# EAGLE board apu_standalone (EAGLE 6.5.0)
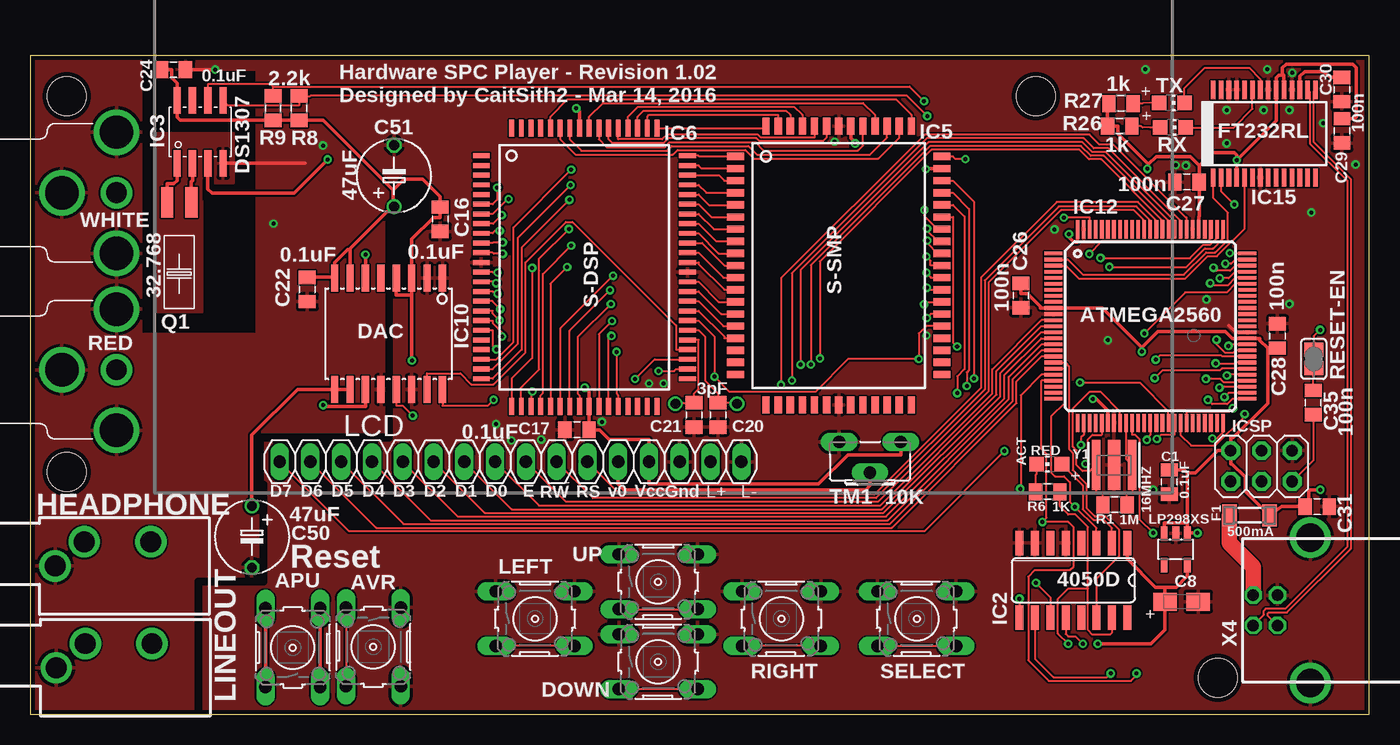
[diagram p6: board, top side]
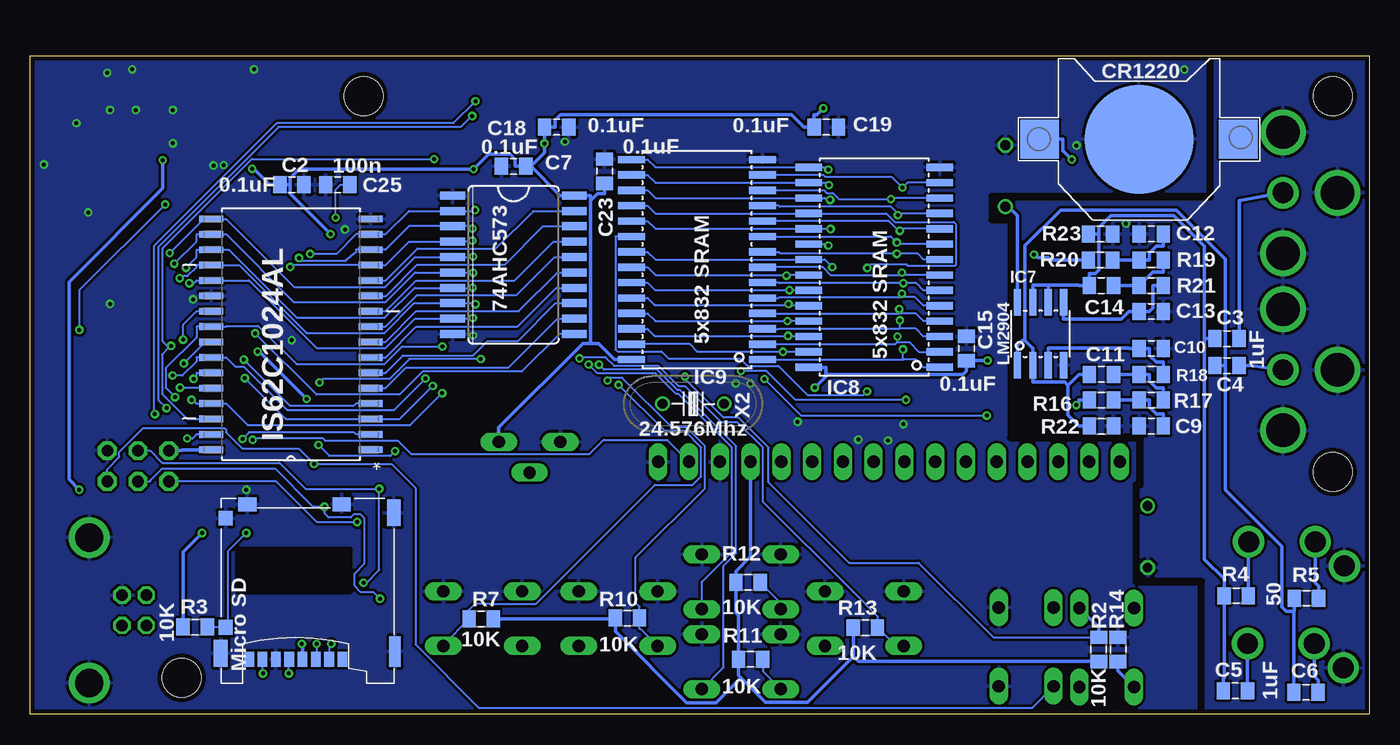
[diagram p7: board, bottom side, seen from below]

Size 110.49 x 54.36 mm. Coordinates in mm from the lower left corner, seen from the top.
Outline: 0,0 110.49,0 110.49,54.36 0,54.36 0,0
Copper layers (1*16): Top 0.0356mm / dielectric 1.5011mm / Bottom 0.0356mm
Design rules "oshpark-2layer": minimum track width 6mil, minimum drill 13mil, track to track 6mil, track to pad 6mil, pad to pad 6mil, via to via 6mil, smd to smd 6mil, copper to edge 15mil, drill to drill 6mil, minimum pad ring 7mil, minimum via ring 7mil, stop-mask expansion 4mil, vias tented up to drill 0mil, thermal gap 10mil
Net classes: 0 default: width 0.152 mm, clearance 0.152 mm; 1 supply: width 0.203 mm, clearance 0.152 mm; 2 audio: width 0.305 mm, clearance 0.152 mm; 3 power usb: width 0.508 mm, drill 0.406 mm, clearance 0.203 mm
Holes 3.2 mm at 3,51 98,3 83,51 3,20
tRestrict: 48 lines
bRestrict: 24 lines

## Footprints (pad centres in the part's own frame; a part is rotated, then mirrored left to right if it is on the bottom)
CHIP-LED0805 = smd 1.2 x 1.2: A 0,-1.05; C 0,1.05
B3F-10XX = drill 1.016 long: 1 -3.251,2.261; 2 3.251,2.261; 3 -3.251,-2.261; 4 3.251,-2.261
CR1220-SMD = smd 3.2 x 3.2: +$1 -8.2,0; +$2 8.2,0 | smd 9 x 9: - 0,0
C0805 = smd 1.1 x 1.4: 1 -1,0; 2 1,0
A/3216-18R = smd 1.95 x 1.5: + 1.375,0; - -1.375,0
TT5D6 = drill 0.813: + -2.54,0 | drill 0.813 octagon: - 2.54,0
SM-1206 = smd 1.2 x 1.8: 1 -1.65,0; 2 1.65,0
SO20W = smd 0.66 x 2.032: 1 -5.715,-5.029; 2 -4.445,-5.029; 3 -3.175,-5.029; 4 -1.905,-5.029; 5 -0.635,-5.029; 6 0.635,-5.029; 7 1.905,-5.029; 8 3.175,-5.029; 9 4.445,-5.029; 10 5.715,-5.029; 11 5.715,5.029; 12 4.445,5.029; 13 3.175,5.029; 14 1.905,5.029; 15 0.635,5.029; 16 -0.635,5.029; 17 -1.905,5.029; 18 -3.175,5.029; 19 -4.445,5.029; 20 -5.715,5.029
SO16 = smd 0.66 x 2.032: 1 -4.445,-3.073; 2 -3.175,-3.073; 3 -1.905,-3.073; 4 -0.635,-3.073; 5 0.635,-3.073; 6 1.905,-3.073; 7 3.175,-3.073; 8 4.445,-3.073; 9 4.445,3.073; 10 3.175,3.073; 11 1.905,3.073; 12 0.635,3.073; 13 -0.635,3.073; 14 -1.905,3.073; 15 -3.175,3.073; 16 -4.445,3.073
SO-08 = smd 0.6 x 2.2: 1 -1.905,-2.6; 2 -0.635,-2.6; 3 0.635,-2.6; 4 1.905,-2.6; 5 1.905,2.6; 6 0.635,2.6; 7 -0.635,2.6; 8 -1.905,2.6
SOT23-5L = smd 0.55 x 1.2: 1 -0.95,-1.3; 2 0,-1.3; 3 0.95,-1.3; 4 0.95,1.3; 5 -0.95,1.3
QFP64_SOT319 = smd 0.6 x 1.4: 1 -9,-8.5; 2 -8,-8.5; 3 -7,-8.5; 4 -6,-8.5; 5 -5,-8.5; 6 -4,-8.5; 7 -3,-8.5; 8 -2,-8.5; 9 -1,-8.5; 10 0,-8.5; 11 1,-8.5; 12 2,-8.5; 13 3,-8.5; 14 4,-8.5; 15 5,-8.5; 16 6,-8.5; 17 7,-8.5; 18 8,-8.5; 19 9,-8.5; 33 9,8.5; 34 8,8.5; 35 7,8.5; 36 6,8.5; 37 5,8.5; 38 4,8.5; 39 3,8.5; 40 2,8.5; 41 1,8.5; 42 0,8.5; 43 -1,8.5; 44 -2,8.5; 45 -3,8.5; 46 -4,8.5; 47 -5,8.5; 48 -6,8.5; 49 -7,8.5; 50 -8,8.5; 51 -9,8.5 | smd 1.4 x 0.6: 20 11.5,-6; 21 11.5,-5; 22 11.5,-4; 23 11.5,-3; 24 11.5,-2; 25 11.5,-1; 26 11.5,0; 27 11.5,1; 28 11.5,2; 29 11.5,3; 30 11.5,4; 31 11.5,5; 32 11.5,6; 52 -11.5,6; 53 -11.5,5; 54 -11.5,4; 55 -11.5,3; 56 -11.5,2; 57 -11.5,1; 58 -11.5,0; 59 -11.5,-1; 60 -11.5,-2; 61 -11.5,-3; 62 -11.5,-4; 63 -11.5,-5; 64 -11.5,-6
QFP80_SOT318 = smd 0.4 x 1.4: 1 -9.2,-8.5; 2 -8.4,-8.5; 3 -7.6,-8.5; 4 -6.8,-8.5; 5 -6,-8.5; 6 -5.2,-8.5; 7 -4.4,-8.5; 8 -3.6,-8.5; 9 -2.8,-8.5; 10 -2,-8.5; 11 -1.2,-8.5; 12 -0.4,-8.5; 13 0.4,-8.5; 14 1.2,-8.5; 15 2,-8.5; 16 2.8,-8.5; 17 3.6,-8.5; 18 4.4,-8.5; 19 5.2,-8.5; 20 6,-8.5; 21 6.8,-8.5; 22 7.6,-8.5; 23 8.4,-8.5; 24 9.2,-8.5; 41 9.2,8.5; 42 8.4,8.5; 43 7.6,8.5; 44 6.8,8.5; 45 6,8.5; 46 5.2,8.5; 47 4.4,8.5; 48 3.6,8.5; 49 2.8,8.5; 50 2,8.5; 51 1.2,8.5; 52 0.4,8.5; 53 -0.4,8.5; 54 -1.2,8.5; 55 -2,8.5; 56 -2.8,8.5; 57 -3.6,8.5; 58 -4.4,8.5; 59 -5.2,8.5; 60 -6,8.5; 61 -6.8,8.5; 62 -7.6,8.5; 63 -8.4,8.5; 64 -9.2,8.5 | smd 1.4 x 0.4: 25 11.5,-6; 26 11.5,-5.2; 27 11.5,-4.4; 28 11.5,-3.6; 29 11.5,-2.8; 30 11.5,-2; 31 11.5,-1.2; 32 11.5,-0.4; 33 11.5,0.4; 34 11.5,1.2; 35 11.5,2; 36 11.5,2.8; 37 11.5,3.6; 38 11.5,4.4; 39 11.5,5.2; 40 11.5,6; 65 -11.5,6; 66 -11.5,5.2; 67 -11.5,4.4; 68 -11.5,3.6; 69 -11.5,2.8; 70 -11.5,2; 71 -11.5,1.2; 72 -11.5,0.4; 73 -11.5,-0.4; 74 -11.5,-1.2; 75 -11.5,-2; 76 -11.5,-2.8; 77 -11.5,-3.6; 78 -11.5,-4.4; 79 -11.5,-5.2; 80 -11.5,-6
SO28X = smd 0.6 x 2.2: 1 -8.255,-5.4; 2 -6.985,-5.4; 3 -5.715,-5.4; 4 -4.445,-5.4; 5 -3.175,-5.4; 6 -1.905,-5.4; 7 -0.635,-5.4; 8 0.635,-5.4; 9 1.905,-5.4; 10 3.175,-5.4; 11 4.445,-5.4; 12 5.715,-5.4; 13 6.985,-5.4; 14 8.255,-5.4; 15 8.255,5.4; 16 6.985,5.4; 17 5.715,5.4; 18 4.445,5.4; 19 3.175,5.4; 20 1.905,5.4; 21 0.635,5.4; 22 -0.635,5.4; 23 -1.905,5.4; 24 -3.175,5.4; 25 -4.445,5.4; 26 -5.715,5.4; 27 -6.985,5.4; 28 -8.255,5.4
SO16W = smd 0.6 x 2.2: 1 -4.445,-4.6; 2 -3.175,-4.6; 3 -1.905,-4.6; 4 -0.635,-4.6; 5 0.635,-4.6; 6 1.905,-4.6; 7 3.175,-4.6; 8 4.445,-4.6; 9 4.445,4.6; 10 3.175,4.6; 11 1.905,4.6; 12 0.635,4.6; 13 -0.635,4.6; 14 -1.905,4.6; 15 -3.175,4.6; 16 -4.445,4.6
SOIC127P1412X305-32N = smd 1.981 x 0.559: 1 -6.579,9.525; 2 -6.579,8.255; 3 -6.579,6.985; 4 -6.579,5.715; 5 -6.579,4.445; 6 -6.579,3.175; 7 -6.579,1.905; 8 -6.579,0.635; 9 -6.579,-0.635; 10 -6.579,-1.905; 11 -6.579,-3.175; 12 -6.579,-4.445; 13 -6.579,-5.715; 14 -6.579,-6.985; 15 -6.579,-8.255; 16 -6.579,-9.525; 17 6.579,-9.525; 18 6.579,-8.255; 19 6.579,-6.985; 20 6.579,-5.715; 21 6.579,-4.445; 22 6.579,-3.175; 23 6.579,-1.905; 24 6.579,-0.635; 25 6.579,0.635; 26 6.579,1.905; 27 6.579,3.175; 28 6.579,4.445; 29 6.579,5.715; 30 6.579,6.985; 31 6.579,8.255; 32 6.579,9.525
TQFP100 = smd 1.5 x 0.3: 1 -8,6; 2 -8,5.5; 3 -8,5; 4 -8,4.5; 5 -8,4; 6 -8,3.5; 7 -8,3; 8 -8,2.5; 9 -8,2; 10 -8,1.5; 11 -8,1; 12 -8,0.5; 13 -8,0; 14 -8,-0.5; 15 -8,-1; 16 -8,-1.5; 17 -8,-2; 18 -8,-2.5; 19 -8,-3; 20 -8,-3.5; 21 -8,-4; 22 -8,-4.5; 23 -8,-5; 24 -8,-5.5; 25 -8,-6; 51 8,-6; 52 8,-5.5; 53 8,-5; 54 8,-4.5; 55 8,-4; 56 8,-3.5; 57 8,-3; 58 8,-2.5; 59 8,-2; 60 8,-1.5; 61 8,-1; 62 8,-0.5; 63 8,0; 64 8,0.5; 65 8,1; 66 8,1.5; 67 8,2; 68 8,2.5; 69 8,3; 70 8,3.5; 71 8,4; 72 8,4.5; 73 8,5; 74 8,5.5; 75 8,6 | smd 0.3 x 1.5: 26 -6,-8; 27 -5.5,-8; 28 -5,-8; 29 -4.5,-8; 30 -4,-8; 31 -3.5,-8; 32 -3,-8; 33 -2.5,-8; 34 -2,-8; 35 -1.5,-8; 36 -1,-8; 37 -0.5,-8; 38 0,-8; 39 0.5,-8; 40 1,-8; 41 1.5,-8; 42 2,-8; 43 2.5,-8; 44 3,-8; 45 3.5,-8; 46 4,-8; 47 4.5,-8; 48 5,-8; 49 5.5,-8; 50 6,-8; 76 6,8; 77 5.5,8; 78 5,8; 79 4.5,8; 80 4,8; 81 3.5,8; 82 3,8; 83 2.5,8; 84 2,8; 85 1.5,8; 86 1,8; 87 0.5,8; 88 0,8; 89 -0.5,8; 90 -1,8; 91 -1.5,8; 92 -2,8; 93 -2.5,8; 94 -3,8; 95 -3.5,8; 96 -4,8; 97 -4.5,8; 98 -5,8; 99 -5.5,8; 100 -6,8
SSOP28 = smd 0.381 x 1.499: 1 -4.225,-3.625; 2 -3.575,-3.625; 3 -2.925,-3.625; 4 -2.275,-3.625; 5 -1.625,-3.625; 6 -0.975,-3.625; 7 -0.325,-3.625; 8 0.325,-3.625; 9 0.975,-3.625; 10 1.625,-3.625; 11 2.275,-3.625; 12 2.925,-3.625; 13 3.575,-3.625; 14 4.225,-3.625; 15 4.225,3.625; 16 3.575,3.625; 17 2.925,3.625; 18 2.275,3.625; 19 1.625,3.625; 20 0.975,3.625; 21 0.325,3.625; 22 -0.325,3.625; 23 -0.975,3.625; 24 -1.625,3.625; 25 -2.275,3.625; 26 -2.925,3.625; 27 -3.575,3.625; 28 -4.225,3.625
2X03 = drill 0.95 pad 1.55 octagon: 1 -2.54,-1.27; 2 -2.54,1.27; 3 0,-1.27; 4 0,1.27; 5 2.54,-1.27; 6 2.54,1.27
1X16 = drill 1.016 long: 1 -19.05,0; 2 -16.51,0; 3 -13.97,0; 4 -11.43,0; 5 -8.89,0; 6 -6.35,0; 7 -3.81,0; 8 -1.27,0; 9 1.27,0; 10 3.81,0; 11 6.35,0; 12 8.89,0; 13 11.43,0; 14 13.97,0; 15 16.51,0; 16 19.05,0
SMD = smd 2.5 x 1: 1 2.25,-1; 2 2.25,1
R0805 = smd 1.1 x 1.4: 1 -1,0; 2 1,0
SJ = smd 1.168 x 1.6: 1 -0.762,0; 2 0.762,0
CA6H = drill 1.016 long: A -2.54,0; E 2.54,0; S 0,2.54
MICROSD-3 = smd 0.8 x 1.24: 1 0,0; 2 1.1,0; 3 2.2,0; 4 3.3,0; 5 4.4,0; 6 5.5,0; 7 6.6,0; 8 7.7,0 | smd 1.16 x 1.2: CD_GND 9.64,-11.62 | smd 1.16 x 1.25: CD_SWITCH 9.64,-2.62 | smd 0.95 x 2.5: G1 -4.345,-0.63 | smd 1.15 x 2.2: G2 10.045,-0.48; G3 -4.245,-12.08 | smd 1.5 x 1.15: G4 0.06,-12.755; G5 7.84,-12.755
SJ1-3533N = drill 1.727: GND -4.7,0; LEFT 3.2,2; RIGHT -2.3,2
RCJ-01X = drill 2.743: PGND1 0,5; PGND2 4.5,0; PGND3 0,-5 | drill 1.727: PSIG 0,0
QS = drill 0.8: 1 -2.54,0; 2 2.54,0
PN61729 = drill 0.95 octagon: 1 1.25,4.71; 2 -1.25,4.71; 3 -1.25,2.71; 4 1.25,2.71 | drill 2.33: P$1 -6,0; P$2 6,0
RESONATOR = smd 0.7 x 4.1: 1 -1.5,0; 3 1.5,0 | smd 1 x 4.1: 2 0,0

## Placement (x,y rotation side)
ACT  RED  [CHIP-LED0805]  84.08,20.64 90 top
APU  Reset  [B3F-10XX]  21.66,5.49 90 top
AVR  Reset  [B3F-10XX]  28.31,5.54 270 top
BAT  CR1220  [CR1220-SMD]  19,47.45 0 bottom
C1  0.1uF  [C0805]  93.98,19.15 270 top
C2  0.1uF  [C0805]  88.9,43.69 180 bottom
C3  1uF  [C0805]  11.73,30.99 0 bottom
C4  1uF  [C0805]  11.73,28.75 0 bottom
C5  1uF  [C0805]  11.04,1.94 0 bottom
C6  1uF  [C0805]  5.22,1.8 0 bottom
C7  0.1uF  [C0805]  70.61,45.21 0 bottom
C8  10uF/10V  [A/3216-18R]  95.01,9.27 180 top
C9  1000pF  [C0805]  17.98,23.77 0 bottom
C10  100pF  [C0805]  17.98,30.18 180 bottom
C11  1800pF  [C0805]  22.1,28.04 180 bottom
C12  1000pF  [C0805]  17.98,39.62 180 bottom
C13  100pF  [C0805]  17.98,33.22 180 bottom
C14  1800pF  [C0805]  22.1,35.36 180 bottom
C15  0.1uF  [C0805]  33.22,30.18 90 bottom
C16  0.1uF  [C0805]  33.83,40.84 270 top
C17  0.1uF  [C0805]  45.11,23.47 180 top
C18  0.1uF  [C0805]  67.06,48.46 0 bottom
C19  0.1uF  [C0805]  44.81,48.46 0 bottom
C20  3pF  [C0805]  56.77,24.69 90 top
C21  3pF  [C0805]  54.79,24.69 90 top
C22  0.1uF  [C0805]  22.86,35.05 90 top
C23  0.1uF  [C0805]  63.09,44.81 90 bottom
C24  0.1uF  [C0805]  11.81,53.19 0 top
C25  100n  [C0805]  85.12,43.69 180 bottom
C26  100n  [C0805]  81.74,34.55 270 top
C27  100n  [C0805]  95.45,43.92 180 top
C28  100n  [C0805]  102.92,31.22 90 top
C29  100n  [C0805]  108.25,48.14 270 top
C30  100n  [C0805]  108.24,51.55 90 top
C31  100n  [C0805]  106.2,17.12 0 top
C35  100n  [C0805]  105.87,25.7 270 top
C50  47uF  [TT5D6]  18.29,14.63 270 top
C51  47uF  [TT5D6]  30.02,44.42 90 top
DOWN  DOWN  [B3F-10XX]  51.82,4.32 0 top
F1  500mA  [SM-1206]  100.62,16.4 180 top
IC1  74AHC573  [SO20W]  70.61,37.08 270 bottom
IC2  4050D  [SO16]  86.08,11.04 180 top
IC3  DS1307  [SO-08]  14.02,48.06 0 top
IC4  LP298XS  [SOT23-5L]  94.53,13.59 180 top
IC5  S-SMP  [QFP64_SOT319]  66.71,37.03 270 top
IC6  S-DSP  [QFP80_SOT318]  45.72,36.88 270 top
IC7  LM2904  [SO-08]  27.13,31.39 0 bottom
IC8  5x832 SRAM  [SO28X]  40.84,36.88 90 bottom
IC9  5x832 SRAM  [SO28X]  55.47,37.52 90 bottom
IC10  DAC  [SO16W]  29.57,31.39 180 top
IC11  IS62C1024AL  [SOIC127P1412X305-32N]  88.98,31.34 180 bottom
IC12  ATMEGA2560  [TQFP100]  92.42,32.02 0 top
IC15  FT232RL  [SSOP28]  101.83,47.9 0 top
ICSP  3x2M  [2X03]  101.6,20.47 0 top
JP1  LCD  [1X16]  39.62,20.83 0 top
LEFT  LEFT  [B3F-10XX]  41.66,7.87 0 top
Q1  32.768  [SMD]  12.29,39.98 90 top
R1  1M  [R0805]  89.5,17.28 180 top
R2  10K  [R0805]  22.33,5.33 90 bottom
R3  10K  [R0805]  96.89,7.19 0 bottom
R4  50  [R0805]  10.97,9.75 180 bottom
R5  50  [R0805]  5.18,9.55 180 bottom
R6  1K  [R0805]  83.97,18.34 180 top
R7  10K  [R0805]  73.28,7.85 180 bottom
R8  2.2k  [R0805]  22.17,50.01 270 top
R9  2.2k  [R0805]  20.04,50.01 90 top
R10  10K  [R0805]  61.21,7.92 0 bottom
R11  10K  [R0805]  51.05,4.53 0 bottom
R12  10K  [R0805]  51.26,10.88 0 bottom
R13  10K  [R0805]  41.58,7.14 0 bottom
R14  470  [R0805]  20.73,5.33 270 bottom
R16  22K  [R0805]  22.1,25.91 180 bottom
R17  22K  [R0805]  17.98,25.91 180 bottom
R18  22K  [R0805]  17.98,28.04 180 bottom
R19  22K  [R0805]  17.98,37.49 180 bottom
R20  22K  [R0805]  22.17,37.49 0 bottom
R21  22K  [R0805]  17.98,35.36 180 bottom
R22  5.1K  [R0805]  22.1,23.77 0 bottom
R23  5.1K  [R0805]  22.17,39.62 0 bottom
R26  1k  [R0805]  89.9,48.53 180 top
R27  1k  [R0805]  90,50.39 180 top
RESET-EN  [SJ]  105.92,29.31 90 top
RIGHT  RIGHT  [B3F-10XX]  61.98,7.87 0 top
RX  [CHIP-LED0805]  94.28,48.42 270 top
SELECT  SELECT  [B3F-10XX]  73.15,7.87 0 top
TM1  10K  [CA6H]  69.29,22.47 180 top
TX  [CHIP-LED0805]  94.2,50.45 270 top
U$1  MICROSD-2  [MICROSD-3]  84.73,4.53 180 bottom
U$2  HEADPHONE  [SJ1-3533N]  6.75,12.22 0 top
U$3  HEADPHONE  [SJ1-3533N]  6.84,3.82 0 top
U$4  RCA  [RCJ-01X]  7.11,43.02 180 top
U$5  RCA  [RCJ-01X]  7.11,28.42 180 top
UP  UP  [B3F-10XX]  51.82,10.92 0 top
X2  24.576Mhz  [QS]  55.78,25.6 180 bottom
X4  [PN61729]  105.63,8.56 90 top
Y1  16MHZ  [RESONATOR]  89.43,20.56 0 top

## Tracks (layer width: path | path; a pad name or v marks a point on that pad's centre or on a via)
!CE0  (via drill 0.33 pad 0.69)
  Top 0.152: IC6.28 42.12,26.31 42.3,26.49 42.3,36.33 v44.64,38.66
  Bottom 0.152: IC8.20 44.76,38.79 v44.64,38.66
!CE1  (via drill 0.33 pad 0.69)
  Top 0.152: v41.44,26.63 41.32,26.51 IC6.27
  Bottom 0.152: IC9.20 62.2,39.42 62.2,30.09 62.05,29.93 58.41,29.93 57.82,29.35 51.9,29.35 51.29,28.73 48.75,28.73 46.36,26.34 41.73,26.34 v41.44,26.63
!OE  (via drill 0.33 pad 0.69)
  Top 0.152: v48.09,36.18 43.72,31.81 IC6.30
  Bottom 0.152: IC9.22 59.55,36.88 58.91,36.25 48.09,36.25 | 48.09,36.25 v48.09,36.18 | IC8.22 48.09,36.25
!RD  (via drill 0.33 pad 0.69)
  Top 0.152: IC5.46 76.14,41.03 76.14,30.68 v76.49,30.34 | IC12.52 98.9,26.52 v98.55,26.16
  Bottom 0.152: v76.49,30.34 79.8,30.34 81.25,28.88 88.53,28.88 91.7,32.05 94.26,32.05 94.33,31.98 IC11.24 96.77,31.98 96.77,31.09 99.32,28.55 99.32,26.94 v98.55,26.16
!WE  (via drill 0.33 pad 0.69)
  Top 0.152: v48.38,29.9 48.38,26.45 48.52,26.31 IC6.36
  Bottom 0.152: IC8.27 v48.38,29.9 55.43,29.9 56.06,30.53 IC9.27
!WR  (via drill 0.33 pad 0.69)
  Top 0.152: IC12.51 99.21,26.02 98.77,25.58 97.53,25.58 v97.18,25.93 | IC5.47 76.14,42.03 77.09,41.08 77.09,28.47 76.5,27.88 v76.5,26.49
  Bottom 0.152: v76.5,26.49 79.14,23.85 92.56,23.85 94.33,25.63 IC11.29 96.77,25.63 97.08,25.93 v97.18,25.93
+3V3  (via drill 0.33 pad 0.69)
  Top 0.305: 93.63,10.47 94.56,10.47 95.48,11.39 IC4.5 | 93.63,10.47 92.85,10.47 90.53,12.79 IC2.1 | 93.63,10.47 C8.+ 93.63,6.94 92.49,5.79 v88.09,5.79
  Bottom 0.305: U$1.4 88.03,5.74 v88.09,5.79
A0
  Bottom 0.152: IC11.12 81.18,35.79 78.54,38.42 72.08,38.42 68.97,41.53 IC1.19
A1
  Bottom 0.152: IC11.11 81.14,34.52 78.56,37.09 71.33,37.09 68.16,40.26 IC1.18
A2
  Bottom 0.152: IC11.10 81.16,33.25 78.64,35.77 70.53,35.77 67.31,38.99 IC1.17
A3
  Bottom 0.152: IC11.9 81.18,31.98 78.56,34.6 70.36,34.6 67.24,37.72 IC1.16
A4
  Bottom 0.152: IC11.8 81.18,30.71 78.63,33.25 70.19,33.25 67,36.45 IC1.15
A5
  Bottom 0.152: IC11.7 81.18,29.44 78.65,31.97 70.29,31.97 67.08,35.18 IC1.14
A6
  Bottom 0.152: IC11.6 81.18,28.17 79.73,29.61 73.95,29.61 72.77,30.79 70.25,30.79 67.13,33.91 IC1.13
A7
  Bottom 0.152: IC11.5 81.18,26.9 79.47,28.61 71.03,28.61 67,32.64 IC1.12
A8  (via drill 0.33 pad 0.69)
  Top 0.152: IC12.53 98.21,27.02 v98.14,26.94
  Bottom 0.152: IC11.28 98.09,26.9 v98.14,26.94
A9  (via drill 0.33 pad 0.69)
  Top 0.152: IC12.54 99.44,27.52 99.3,27.37 98.51,27.37 98.22,27.67 v97.03,27.67
  Bottom 0.152: v97.03,27.67 96.77,27.92 96.77,28.17 IC11.27
A10  (via drill 0.33 pad 0.69)
  Top 0.152: IC12.55 98.82,28.02 v98.75,27.94 | IC5.49 76.14,44.03 77.89,42.28 v77.89,27.69
  Bottom 0.152: v98.75,27.94 97.94,27.94 96.77,29.11 96.77,29.44 IC11.26 94.33,29.44 93.58,28.68 92.86,28.68 89.28,25.1 80.47,25.1 v77.89,27.69
A11  (via drill 0.33 pad 0.69)
  Top 0.152: IC5.48 76.14,43.03 77.47,41.7 77.47,28.39 77.28,28.2 v77.28,27.07 | IC12.56 98.33,28.52 98.18,28.37 93.42,28.37 v92.78,27.72
  Bottom 0.152: v77.28,27.07 80,24.36 IC11.3 89.42,24.36 v92.78,27.72
A12  (via drill 0.33 pad 0.69)
  Top 0.152: IC12.57 99.44,29.02 99.38,28.95 v97.82,28.95
  Bottom 0.152: v97.82,28.95 96.06,30.71 IC11.25
A13  (via drill 0.33 pad 0.69)
  Top 0.152: IC12.58 98.36,29.52 98.31,29.57 93.19,29.57 v92.87,29.25
  Bottom 0.152: IC11.4 83.62,25.63 83.81,25.43 89.05,25.43 v92.87,29.25
A14  (via drill 0.33 pad 0.69)
  Top 0.152: IC12.59 99.44,30.02 99.25,29.82 98.61,29.82 97.89,30.55 v97.89,30.91
  Bottom 0.152: v97.89,30.91 97.89,32.14 96.77,33.25 IC11.23
A15  (via drill 0.33 pad 0.69)
  Top 0.152: IC12.60 99,30.52 v98.88,30.39 | v77.17,45.81 76.36,45.81 76.14,46.03 IC5.51
  Bottom 0.152: 99.06,30.25 99.02,30.25 v98.88,30.39 | 99.06,30.25 99.62,29.68 99.62,26.43 97.55,24.36 | 97.55,24.36 | 97.55,24.36 IC11.30 | 99.06,30.25 99.56,30.75 99.56,38.46 92.21,45.81 v77.17,45.81
A16  (via drill 0.33 pad 0.69)
  Top 0.152: IC12.50 98.42,23.26 97.92,22.76 v97.54,22.76
  Bottom 0.152: IC11.31 96.77,23.09 97.11,22.76 v97.54,22.76
A17  (via drill 0.33 pad 0.69)
  Top 0.152: v92.97,22.71 93.31,23.04 94.42,23.04 IC12.42
  Bottom 0.152: v92.97,22.71 92.43,23.25 83.78,23.25 83.62,23.09 IC11.2
A18  (via drill 0.33 pad 0.69)
  Top 0.152: v38.74,39.89 38.36,39.89 38.15,39.68 IC6.9
  Bottom 0.152: IC8.10 38.58,40.06 v38.74,39.89 38.85,39.89 39.65,40.69 IC9.10
A19  (via drill 0.33 pad 0.69)
  Top 0.152: v38.99,38.93 38.2,38.93 38.15,38.88 IC6.10
  Bottom 0.152: IC8.9 38.85,38.79 v38.99,38.93 39.49,39.42 IC9.9
A20  (via drill 0.33 pad 0.69)
  Top 0.152: v38.99,38 38.23,38 38.15,38.08 IC6.11
  Bottom 0.152: IC9.8 48.74,38.15 48.64,38.04 39.04,38.04 v38.99,38 37.25,38 36.77,37.52 IC8.8
A21  (via drill 0.33 pad 0.69)
  Top 0.152: v38.56,36.44 38.19,36.44 38.15,36.48 IC6.13
  Bottom 0.152: IC8.7 38.37,36.25 v38.56,36.44 38.79,36.22 44.43,36.22 45.09,36.88 IC9.7
A22  (via drill 0.33 pad 0.69)
  Top 0.152: v38.43,35.57 38.26,35.57 38.15,35.68 IC6.14
  Bottom 0.152: IC8.6 36.77,34.98 37.37,35.57 v38.43,35.57 48.7,35.57 48.74,35.61 IC9.6
A23  (via drill 0.33 pad 0.69)
  Top 0.152: v38.57,34.7 38.33,34.7 38.15,34.88 IC6.15
  Bottom 0.152: IC9.5 48.74,34.34 48.67,34.41 38.57,34.41 | IC8.5 36.77,33.71 37.48,34.41 38.57,34.41 | 38.57,34.41 v38.57,34.7
A24  (via drill 0.33 pad 0.69)
  Top 0.152: v38.79,33.42 38.15,34.06 38.15,34.08 IC6.16
  Bottom 0.152: IC8.4 36.77,32.44 37.41,33.07 38.79,33.07 | 38.79,33.07 v38.79,33.42 | IC9.4 38.79,33.07
A25  (via drill 0.33 pad 0.69)
  Top 0.152: v38.73,32.49 38.15,33.08 38.15,33.28 IC6.17
  Bottom 0.152: IC8.3 36.77,31.17 37.41,31.81 38.73,31.81 | IC9.3 48.74,31.8 48.74,31.81 38.73,31.81 | 38.73,31.81 v38.73,32.49
A26  (via drill 0.33 pad 0.69)
  Top 0.152: v48,32.44 46.92,31.36 IC6.34
  Bottom 0.152: IC9.25 59.55,33.07 58.91,32.44 v48,32.44 IC8.25
A27  (via drill 0.33 pad 0.69)
  Top 0.152: v47.91,33.84 45.17,31.1 45.17,26.45 45.32,26.31 IC6.32
  Bottom 0.152: 47.91,33.76 v47.91,33.84 | IC8.24 47.86,33.71 47.91,33.76 | IC9.24 59.55,34.34 58.97,33.76 47.91,33.76
A28  (via drill 0.33 pad 0.69)
  Top 0.152: v44.31,36.9 42.92,35.52 IC6.29
  Bottom 0.152: v44.31,36.9 44.91,37.51 44.91,37.52 IC8.21 58.91,37.52 59.55,38.15 IC9.21
A29  (via drill 0.33 pad 0.69)
  Top 0.152: IC6.31 44.52,31.66 v47.85,34.99
  Bottom 0.152: IC9.23 59.55,35.61 58.92,34.99 v47.85,34.99 47.84,34.98 IC8.23
A30  (via drill 0.33 pad 0.69)
  Top 0.152: IC6.18 38.15,32.48 38.15,32.27 38.94,31.48 v38.94,31.16
  Bottom 0.152: 38.94,30.69 37.95,30.69 37.15,29.9 IC8.2 | IC9.2 39.1,30.53 38.94,30.69 | 38.94,30.69 v38.94,31.16
A31  (via drill 0.33 pad 0.69)
  Top 0.152: IC6.35 47.72,30.99 v47.95,31.22
  Bottom 0.152: IC8.26 47.9,31.17 v47.95,31.22 58.96,31.22 59.55,31.8 IC9.26
A32  (via drill 0.33 pad 0.69)
  Top 0.152: IC6.19 38.15,31.68 38.15,30.42 v38.46,30.1
  Bottom 0.152: IC8.1 36.77,28.63 37.41,29.26 38.46,29.26 | 38.46,29.26 v38.46,30.1 | IC9.1 38.46,29.26
A.REF
  Top 0.305: C50.+ 18.29,23.02 22.06,26.79 IC10.9 IC10.10
ALEFT
  Bottom 0.305: IC7.7 27.76,35.4 26.49,35.4 | IC7.6 26.49,35.4 | 26.49,35.4 24,35.4 23.95,35.36 C14.2 23.1,36.36 22.61,36.36 22.32,36.65 22.32,39.62 | C5.1 12.04,2.94 11.97,3.01 R4.2 11.97,11.14 13.59,12.76 13.59,30.99 | R23.1 22.32,39.62 | 13.59,30.99 13.59,38.61 16.12,41.14 21.34,41.14 22.32,40.16 22.32,39.62 | C3.1 13.59,30.99
AREF  (via drill 0.33 pad 0.69)
  Top 0.152: IC12.98 87.42,40.99 85.31,40.99 v85.3,40.98
  Bottom 0.152: v85.3,40.98 85.3,43.28 84.89,43.69 C25.1
ARIGHT
  Bottom 0.305: 28.39,30.82 28.39,38.66 25.46,41.6 15.93,41.6 11.88,37.55 11.88,28.75 | 6.22,8.49 6.84,8.49 7.2,8.85 7.2,13.84 11.88,18.52 11.88,28.75 | R5.2 6.18,8.53 6.22,8.49 | IC7.1 29.03,30.4 28.62,30.82 28.39,30.82 | 28.39,30.82 27.78,30.2 27.76,30.2 IC7.2 27.76,27.39 25.1,27.39 24.85,27.14 | C4.1 11.88,28.75 | C6.1 6.22,8.49 | R22.1 23.95,23.77 24.85,24.68 24.85,27.14 | C11.2 23.95,28.04 24.85,27.14
BCK  (via drill 0.33 pad 0.69)
  Top 0.152: IC10.16 34.01,25.47 37.76,25.47 v38.23,25.94 | v51.84,28.32 53.12,28.32 53.29,28.48 IC6.42
  Bottom 0.152: v38.23,25.94 47.35,25.94 49.73,28.32 v51.84,28.32
BUF_CLK  (via drill 0.33)
  Top 0.152: IC2.10 82.91,4.57 84.43,3.05 88.85,3.05 v89.15,3.35
  Bottom 0.152: v89.15,3.35 89.15,4.51 U$1.5
BUF_CS  (via drill 0.33)
  Top 0.152: 87.28,10.36 87.28,6.94 87.66,6.55 89.09,6.55 89.26,6.72 IC2.15 | 87.28,10.36 87.28,15.44 86.26,16.46 85.65,16.46 84.97,17.14 R6.1 | 87.28,10.36 85.65,10.36 84.81,9.53 84.81,6.63 v85.65,5.79
  Bottom 0.152: v85.65,5.79 85.83,5.61 U$1.2
BUF_DI  (via drill 0.33)
  Top 0.152: IC2.12 85.45,6.6 85.65,6.4 86.26,6.4 v86.87,5.79
  Bottom 0.152: v86.87,5.79 86.87,4.6 U$1.3
BUF_LED
  Top 0.152: ACT.A 85.13,20.6 86.86,18.87 86.86,16.9 87.73,16.03 88.59,16.03 89.26,15.36 IC2.2
CD  (via drill 0.33)
  Top 0.152: IC12.35 90.92,23.04 91.19,23.04 91.51,22.71 91.51,16.08 v92.66,14.94
  Bottom 0.152: v92.66,14.94 94.18,13.41 94.18,7.34 U$1.CD_SWITCH 94.41,7.19 R3.2
CLK  (via drill 0.33)
  Top 0.152: IC2.3 87.99,15.36 87.97,15.36 v86.22,17.11 85.81,17.52 85.81,19.12 85.31,19.62 84.57,19.62 84.23,19.95 84.23,24.56 85.4,25.73 85.4,28.52 IC12.20 | v81.64,9.53 IC2.9
  Bottom 0.152: ICSP.3 100.58,19.2 100.58,19.28 99.59,20.27 90.3,20.27 87.17,17.14 86.26,17.14 v86.22,17.11 86.22,16.57 85.88,16.23 84.05,16.23 83.82,16.46 83.21,16.46 82.91,16.15 82.91,12.42 83.74,11.58 83.74,10.59 83.21,10.06 82.17,10.06 v81.64,9.53
CS
  Top 0.152: IC2.14 87.99,11.17 89.82,13 89.82,15.25 88.73,16.33 87.86,16.33 87.16,17.03 87.16,19 86.03,20.13 86.03,21.55 85.71,21.86 85.71,28.71 85.4,29.02 IC12.19
D0  (via drill 0.33 pad 0.69)
  Top 0.152: IC12.78 97.42,39.28 97.17,39.04 88.44,39.04 v87.39,37.98 | IC5.45 74.86,40.03 73.79,41.1 | 73.79,41.1 | 73.79,41.1 v73.79,41.61
  Bottom 0.152: v87.39,37.98 85.23,37.98 83.62,39.6 IC11.15 81.18,39.6 79.25,41.53 IC1.2 73.87,41.53 v73.79,41.61
D1  (via drill 0.33 pad 0.69)
  Top 0.152: v88.32,37.65 95.7,37.63 96.8,38.73 97.37,38.73 97.92,39.28 IC12.77 | IC5.44 74.88,39.03 74.01,39.9 | 74.01,39.9 | 74.01,39.9 v74.01,40.07
  Bottom 0.152: v88.32,37.65 88.1,37.39 84.51,37.39 83.62,38.15 83.62,38.33 IC11.14 81.18,38.33 79.25,40.26 IC1.3 74.19,40.26 v74.01,40.07
D2  (via drill 0.33 pad 0.69)
  Top 0.152: v89.05,36.91 95.41,36.91 96.93,38.43 97.62,38.43 98.42,39.23 IC12.76 | IC5.43 74.86,38.03 74.01,38.88 v74.01,39.09
  Bottom 0.152: v74.01,39.09 74.3,39.09 74.4,38.99 IC1.4 79.25,38.99 81.18,37.06 IC11.13 88.89,37.06 v89.05,36.91
D3  (via drill 0.33 pad 0.69)
  Top 0.152: IC5.42 74.28,37.03 74.28,37.43 v73.95,37.76 | IC12.75 99.02,38.02 v98.98,38.05
  Bottom 0.152: v73.95,37.76 73.99,37.72 IC1.5 78.74,37.72 81.21,35.25 88.72,35.25 94.33,40.87 IC11.17 96.17,40.87 v98.98,38.05
D4  (via drill 0.33 pad 0.69)
  Top 0.152: v73.94,36.43 74.28,36.09 74.28,36.03 IC5.41 | IC12.74 99.44,37.52 99.1,37.17 v98.62,37.17
  Bottom 0.152: v73.94,36.43 73.97,36.45 IC1.6 78.74,36.45 81.18,34 88.74,34 94.33,39.6 IC11.18 96.77,39.6 96.77,39.02 v98.62,37.17
D5  (via drill 0.33 pad 0.69)
  Top 0.152: v73.99,35.19 74.12,35.19 74.28,35.03 IC5.40 | IC12.73 99.44,37.02 99.02,36.59 97.89,36.59 v97.63,36.84
  Bottom 0.152: v73.99,35.19 74,35.18 IC1.7 78.77,35.18 81.23,32.71 88.49,32.71 94.11,38.33 IC11.19 96.77,38.33 96.77,37.7 v97.63,36.84
D6  (via drill 0.33 pad 0.69)
  Top 0.152: v73.76,33.83 73.96,34.03 IC5.39 | IC12.72 99.44,36.52 98.9,35.97 v98.16,35.97
  Bottom 0.152: v73.76,33.83 73.84,33.91 IC1.8 78.82,33.91 81.26,31.47 87.68,31.47 93.27,37.06 IC11.20 96.77,37.06 96.77,36.89 97.53,36.13 98,36.13 v98.16,35.97
D7  (via drill 0.33 pad 0.69)
  Top 0.152: IC5.38 74.28,33.03 74.28,32.99 v73.97,32.68 | IC12.71 99.43,36.02 98.8,35.39 97.54,35.39 v97.36,35.56
  Bottom 0.152: v73.97,32.68 74.02,32.64 IC1.9 78.74,32.64 81.18,30.2 86.84,30.2 92.43,35.79 IC11.21 96.77,35.79 97,35.56 v97.36,35.56
D8  (via drill 0.33 pad 0.69)
  Top 0.152: v38.91,41.18 38.2,40.48 IC6.8
  Bottom 0.152: 38.91,41.33 v38.91,41.18 | IC8.11 38.91,41.33 | 38.91,41.33 39.45,41.87 48.66,41.87 48.74,41.96 IC9.11
D9  (via drill 0.33 pad 0.69)
  Top 0.152: v39.47,42.51 39.37,42.51 38.15,41.28 IC6.7
  Bottom 0.152: IC8.12 39.38,42.6 v39.47,42.51 43.74,42.51 | IC9.12 45,43.23 44.79,43.02 44.26,43.02 43.74,42.51 | 43.74,42.51
D10  (via drill 0.33 pad 0.69)
  Top 0.152: v38.52,43.45 38.52,42.45 38.15,42.08 IC6.6
  Bottom 0.152: IC8.13 38.11,43.87 v38.52,43.45 39.4,44.33 44.88,44.33 45.05,44.5 IC9.13
D11  (via drill 0.33 pad 0.69)
  Top 0.152: IC6.22 38.45,29.28 39.88,30.71 39.88,40.17 v44.64,44.93
  Bottom 0.152: IC9.15 59.55,45.77 58.91,45.14 IC8.15 44.84,45.14 v44.64,44.93
D12  (via drill 0.33 pad 0.69)
  Top 0.152: IC6.23 38.15,28.48 40.24,30.57 40.24,39.32 v44.59,43.67
  Bottom 0.152: v44.59,43.67 44.79,43.87 IC8.16 58.91,43.87 59.55,44.5 IC9.16
D13  (via drill 0.33 pad 0.69)
  Top 0.152: v44.49,42.45 40.55,38.5 40.55,30.08 38.15,27.68 IC6.24
  Bottom 0.152: IC9.17 59.55,43.23 58.91,42.6 IC8.17 44.91,42.6 44.76,42.45 v44.49,42.45
D14  (via drill 0.33 pad 0.69)
  Top 0.152: v41.42,36.83 41.42,29.39 39.72,27.69 IC6.25
  Bottom 0.152: IC9.18 59.55,41.96 58.91,41.33 IC8.18 39.86,41.33 39.14,40.61 34.27,40.61 34.11,40.45 34.11,37.06 34.19,36.99 38.05,36.99 38.15,37.09 41.17,37.09 v41.42,36.83
D15  (via drill 0.33 pad 0.69)
  Top 0.152: IC6.26 40.52,26.98 41.99,28.45 41.99,36.59 41.99,37.6 v44.44,40.05
  Bottom 0.152: v44.44,40.05 v44.45,40.06 IC8.19 58.91,40.06 59.55,40.69 IC9.19
D_N
  Top 0.152: X4.2 101.8,8.2 101.8,8.53 101.96,8.69 103.57,8.69 108.66,13.78 108.66,44.03 105.59,47.1 105.59,51.34 IC15.16
D_P
  Top 0.152: X4.3 102.13,8.1 102.13,8.33 102.18,8.38 103.69,8.38 108.97,13.65 108.97,44.16 105.89,47.23 105.89,51.36 IC15.15
DI  (via drill 0.33 pad 0.69)
  Top 0.152: IC12.21 83.44,28.02 81.74,26.32 81.74,18.65 v81.69,18.59 | v82.99,10.83 84.18,9.64 IC2.11
  Bottom 0.152: ICSP.4 100.6,21.74 99.59,20.74 89.93,20.74 87.78,18.59 v81.69,18.59 81.69,11.89 82.74,10.83 v82.99,10.83
DO  (via drill 0.33)
  Top 0.152: IC12.22 83.44,27.52 83.44,21.9 83.86,21.49 83.86,16.19 v83.52,15.85 85.65,15.85 86.11,15.39 86.11,12.19 85.8,11.89 82.91,11.89 82.34,11.33 82.34,4.45 84.05,2.74 90.83,2.74 91.29,3.2 v91.29,3.35
  Bottom 0.152: v91.29,3.35 91.33,3.4 U$1.7 | v83.52,15.85 86.85,15.85 90.2,19.2 ICSP.1
DOWN  (via drill 0.33 pad 0.69)
  Top 0.152: IC12.84 94.42,40.75 88.78,46.4 87.63,46.4 86.82,47.2 74.13,47.2 63.57,36.65 v63.57,28.84 | DOWN.4 DOWN.3
  Bottom 0.152: R11.2 50.05,3.54 DOWN.3 | DOWN.4 53.27,3.85 53.27,9.4 53.27,12.24 52.25,13.27 52.25,22.13 56.86,26.74 57.08,26.74 58.76,28.42 63.15,28.42 v63.57,28.84
DSP_A0
  Top 0.152: IC6.60 55.15,42.88 56,42.03 IC5.5
DSP_A1
  Top 0.152: IC6.61 55.15,43.68 55.8,43.03 IC5.4
DSP_A2
  Top 0.152: IC6.62 56.83,44.48 57.28,44.03 IC5.3
DSP_A3
  Top 0.152: IC5.2 55.4,45.03 55.15,45.28 IC6.63
DSP_A4
  Top 0.152: IC5.1 55.2,46.03 55.15,46.08 IC6.64
DSP_A5
  Top 0.152: IC6.65 60.56,48.38 IC5.64
DSP_A6
  Top 0.152: IC6.66 50.92,49.31 51.07,49.46 61.71,49.46 IC5.63
DSP_A7
  Top 0.152: IC6.67 50.12,49.31 50.6,49.79 62.38,49.79 62.71,49.46 IC5.62
DSP_A8
  Top 0.152: IC6.68 49.32,49.31 50.14,50.13 63.04,50.13 63.71,49.46 IC5.61
DSP_A9
  Top 0.152: IC5.60 64.71,47.6 60.29,47.6 60.05,47.84 52.53,47.84 52.14,47.45 48.52,47.45 IC6.69
DSP_A10
  Top 0.152: IC5.59 65.71,47.6 65.4,47.29 60.17,47.29 59.92,47.54 52.66,47.54 52.25,47.12 48.05,47.12 47.72,47.45 IC6.70
DSP_A11
  Top 0.152: IC6.71 46.92,47.45 47.56,46.81 52.37,46.81 52.75,47.19 59.84,47.19 60.51,46.52 68.3,46.52 68.71,46.94 IC5.56
DSP_A12
  Top 0.152: IC6.72 46.12,49.31 47.25,50.44 68.73,50.44 69.71,49.46 IC5.55
DSP_A13
  Top 0.152: IC6.74 44.52,47.45 45.47,46.5 52.55,46.5 52.94,46.89 59.26,46.89 59.98,46.17 69.28,46.17 70.71,47.6 IC5.54
DSP_A14
  Top 0.152: IC6.75 43.72,47.45 44.99,46.18 53.04,46.18 53.42,46.56 59.02,46.56 59.71,45.87 69.98,45.87 71.71,47.6 IC5.53
DSP_A15
  Top 0.152: IC6.76 42.92,49.31 44.35,50.74 71.43,50.74 72.71,49.46 IC5.52
DSP_CPUK
  Top 0.152: IC6.48 55.15,33.28 57.28,31.15 57.28,31.03 IC5.16
DSP_D0
  Top 0.152: IC6.51 55.15,35.68 56.8,34.03 IC5.13
DSP_D1
  Top 0.152: IC6.53 55.15,37.28 55.15,37.16 57.28,35.03 IC5.12
DSP_D2
  Top 0.152: IC6.54 55.15,38.08 57.2,36.03 IC5.11
DSP_D3
  Top 0.152: IC6.55 55.43,38.88 57.28,37.03 IC5.10
DSP_D4
  Top 0.152: IC6.56 55.15,39.68 56.8,38.03 IC5.9
DSP_D5
  Top 0.152: IC6.57 55.15,40.48 56.6,39.03 IC5.8
DSP_D6
  Top 0.152: IC6.58 55.15,41.28 56.4,40.03 IC5.7
DSP_D7
  Top 0.152: IC6.59 55.15,42.08 56.2,41.03 IC5.6
DSP_PD2
  Top 0.152: IC6.49 55.15,34.08 57.2,32.03 IC5.15
DSP_PD3
  Top 0.152: IC6.50 55.15,34.88 57,33.03 IC5.14
DTR  (via drill 0.33 pad 0.69)
  Top 0.152: IC15.2 98.26,43.17 v99.36,42.06 | v106.44,31.71 105.92,31.19 RESET-EN.2 RESET-EN.1 105.87,28.5 C35.1
  Bottom 0.152: v99.36,42.06 106.44,34.99 v106.44,31.71
GND  (via drill 0.33 pad 0.69)
  Top 0.305: IC3.4 22.67,45.46 | v15.26,53.2 13.68,53.2 13.67,53.19 C24.2 | IC12.62 99.47,31.52 98.91,32.08
  other vias: 106.68,48.77 103.91,49.86 104.14,52.93 109.37,45.36 102.08,53.21 98.73,49.86 101.78,49.86 98.73,47.12 92.02,53.21 39.7,22.58 42.16,22.66 38.43,23.93 47.17,24.13 51.05,27.28 52.27,27.28 94.54,45.31 95.38,45.29 20.07,40.49 103.91,33.86 105.71,41.4 92.66,18.52 73.96,31.24 97.06,34.23 24.16,46.94 66.37,47.24 84.53,40 88.92,30.87
  pour Top: 10.52,33.17 10.52,47.96 16.76,47.96 16.76,43.84 15.24,43.84 15.24,46.58 14.17,46.58 14.17,33.17
  pour Bottom (isolate 0.203): 0,53.85 111,53.85 111,0.51 0,0.51
  pour Top (isolate 0.152): 0,54.36 9.09,54.36 9.09,31.34 18.72,31.34 18.72,53.21 10.87,53.21 10.87,54.36 110.36,54.36 110.36,0 0,0
L1
  Bottom 0.305: R20.2 R19.2 18.13,37.49 18.13,38.05 17.56,38.62 16.98,38.62 C12.1
L2
  Bottom 0.305: R19.1 16.98,36.49 17.86,36.49 R21.2 C14.1
L3
  Bottom 0.305: IC7.5 25.22,32.59 20.47,32.59 19.84,33.22 C13.2 18.13,33.22 17.84,33.51 17.84,35.36 R21.1
L.OUT  (via drill 0.33 pad 0.69)
  Top 0.305: v24.17,25.49 24.27,25.39 27.66,25.39 IC10.11
  Bottom 0.305: R16.2 23.95,25.91 23.95,25.71 v24.17,25.49
LCD_D0
  Top 0.152: IC12.12 83.44,32.52 79.38,28.45 79.38,26.45 70.14,17.21 41.97,17.21 JP1.8
LCD_D1
  Top 0.152: JP1.7 39.73,16.91 70.27,16.91 79.73,26.36 79.73,28.32 83.42,32.02 IC12.13
LCD_D2
  Top 0.152: JP1.6 37.5,16.6 70.42,16.6 80.04,26.23 80.04,28.14 83.42,31.52 IC12.14
LCD_D3
  Top 0.152: JP1.5 35.26,16.3 70.61,16.3 80.37,26.06 80.37,27.97 83.42,31.02 IC12.15
LCD_D4
  Top 0.152: IC12.16 83.44,30.52 80.75,27.83 80.75,25.99 70.76,15.99 33.03,15.99 JP1.4
LCD_D5
  Top 0.152: IC12.17 83.44,30.02 81.08,27.65 81.08,25.85 70.92,15.69 30.79,15.69 JP1.3
LCD_D6
  Top 0.152: IC12.18 83.44,29.52 81.39,27.46 81.39,25.67 71.1,15.38 28.56,15.38 JP1.2
LCD_D7  (via drill 0.33 pad 0.69)
  Top 0.152: v86.71,22.21 86.71,22.82 86.92,23.04 IC12.27 | v80.39,21.7 73.77,15.08 26.32,15.08 JP1.1
  Bottom 0.152: v80.39,21.7 80.79,21.3 85.81,21.3 v86.71,22.21
LCD_E
  Top 0.152: IC12.89 91.92,40.75 91.08,41.59 85.06,41.59 79.07,35.6 79.07,26.64 69.95,17.52 44.2,17.52 JP1.9
LCD_R!W
  Top 0.152: IC12.88 92.42,40.75 91.28,41.9 84.86,41.9 78.76,35.8 78.76,26.8 69.79,17.82 46.44,17.82 JP1.10
LCD_RS
  Top 0.152: IC12.87 92.92,40.75 91.41,42.26 84.7,42.26 78.46,36.02 78.46,26.93 69.66,18.13 48.67,18.13 JP1.11
LE  (via drill 0.33 pad 0.69)
  Top 0.152: IC12.70 99.44,35.52 98.72,34.8 95.3,34.8 v91.93,31.43
  Bottom 0.152: IC1.11 66.83,31.37 69.93,28.26 78.12,28.26 80.02,26.36 86.86,26.36 v91.93,31.43
LEFT  (via drill 0.33 pad 0.69)
  Top 0.152: IC12.86 93.42,40.75 88.39,45.79 87.38,45.79 86.59,46.57 74.38,46.57 65.16,37.36 v65.16,29.36 | LEFT.4 LEFT.3
  Bottom 0.152: v65.16,29.36 65.08,29.45 63.01,29.45 62.28,28.73 58.63,28.73 56.95,27.05 56.42,27.05 53.45,24.07 52.11,24.07 50.03,21.99 50.03,17.52 42.58,10.07 40.58,8.07 R13.2 39.06,5.61 LEFT.3
LRCK  (via drill 0.33 pad 0.69)
  Top 0.152: IC10.13 30.2,25.47 30.73,25.47 v31.56,24.64 | v49.9,27.65 51.53,29.28 IC6.43
  Bottom 0.152: v49.9,27.65 46.89,24.64 v31.56,24.64
M8RXD
  Top 0.152: IC12.2 85.62,37.52 86.87,36.27 95.2,36.27 97.03,38.1 97.79,38.1 98.82,39.13 98.82,41.39 97.61,42.6 IC15.1
M8TXD
  Top 0.152: IC12.3 85.47,37.02 86.52,35.97 95.33,35.97 97.16,37.79 97.92,37.79 100.21,40.08 IC15.5
N$1
  Top 0.152: RX.C 99.32,48.42 100.86,49.96 IC15.23
N$2
  Bottom 0.305: U$4.PSIG 10.73,42.4 C3.2
N$3
  Bottom 0.305: U$5.PSIG 9.78,28.75 C4.2
N$4
  Bottom 0.305: U$3.LEFT C5.2
N$5
  Top 0.305: APU.1 APU.2
  Bottom 0.305: R14.2 20.73,3.56 APU.1
N$8
  Bottom 0.305: U$3.RIGHT 4.54,3.12 4.22,2.8 C6.2
N$9
  Bottom 0.305: U$2.LEFT 9.97,14.19 R4.1
N$10
  Bottom 0.305: U$2.RIGHT 4.45,10.82 4.18,10.55 R5.1
N$11
  Top 0.152: ACT.C 83.03,19.81 82.97,19.75 82.97,19.27 R6.2
N$13
  Top 0.305: JP1.12 48.51,19 49,18.51 68.94,18.51 69.29,18.86 TM1.S
N$15  (via drill 0.33 pad 0.69)
  Top 0.305: IC3.3 14.66,43.34 15,43 21.77,43 v24.54,45.77
  Bottom 0.305: v24.54,45.77 25.29,46.53 25.29,47.45 BAT.+$1
N$21
  Top 0.305: Q1.2 11.29,43.78 11.85,43.78 12.12,44.05 IC3.1
N$22
  Top 0.305: Q1.1 13.29,43.96 13.39,44.05 IC3.2
N$53
  Top 0.152: TX.C 95.25,51.67 96.93,53.34 100.58,53.34 101.5,52.43 101.5,51.53 IC15.22
N$54
  Top 0.152: RX.A 92.4,48.42 91.77,48.43 91.67,48.53 R26.1
N$55
  Top 0.152: TX.A 91.8,50.41 91.78,50.39 R27.1
N$60
  Top 1.27: F1.2 98.97,14.12 99.97,13.11 100.92,12.16 X4.1
PWM  (via drill 0.33 pad 0.69)
  Top 0.152: v92.14,22.64 92.14,22.75 92.42,23.04 IC12.38
  Bottom 0.152: v92.14,22.64 91.99,22.78 86.37,22.78 86.17,22.58 80.16,22.58 79.06,21.48 64.32,21.48 63.17,22.63 57.93,22.63 JP1.15
R1
  Bottom 0.305: R16.1 R17.2 18.13,25.91 18.13,25.35 17.56,24.78 16.98,24.78 C9.2
R2
  Bottom 0.305: C11.1 R18.2 18.13,28.04 18.13,27.48 17.56,26.91 16.98,26.91 R17.1
R3
  Bottom 0.305: IC7.3 26.49,30.2 19.86,30.2 19.84,30.18 C10.2 18.13,30.18 18.13,29.61 17.56,29.05 16.98,29.05 R18.1
R.OUT  (via drill 0.33 pad 0.69)
  Top 0.305: v27.66,37.92 IC10.6
  Bottom 0.305: R20.1 26.3,37.49 26.47,37.66 27.4,37.66 v27.66,37.92
RESET  (via drill 0.33 pad 0.69)
  Top 0.152: v87.08,20.64 87.28,20.84 87.28,22.67 87.65,23.04 88.42,23.04 IC12.30 | ICSP.5 105.87,20.93 C35.2 | AVR.3 AVR.4
  Bottom 0.152: AVR.4 27.81,0.52 73.48,0.52 78.7,5.75 78.7,18.66 80.69,20.64 v87.08,20.64 88.35,21.91 92.99,21.91 94.33,23.26 94.33,23.49 94.44,23.6 101.19,23.6 103.14,21.65 103.14,21.21 104.14,20.21 ICSP.5
RIGHT  (via drill 0.33 pad 0.69)
  Top 0.152: IC12.83 94.92,40.75 88.97,46.7 87.75,46.7 86.93,47.53 73.99,47.53 62.85,36.39 v62.85,27.54 | RIGHT.4 RIGHT.3
  Bottom 0.152: v62.85,27.54 62.64,27.75 61.65,27.75 57.55,23.65 56.34,23.65 54.82,22.12 54.82,18.64 60.53,12.93 60.53,9.17 60.21,8.85 R10.2 60.21,7 60.11,7 RIGHT.3
RST  (via drill 0.33 pad 0.69)
  Top 0.152: IC12.41 93.92,25 91.56,27.36 v86.62,27.36 | IC5.37 73.94,32.03 73.32,31.41 v73.32,29.31 67.48,29.31 64.77,26.61 57.7,26.61 v56.45,27.85 56.45,31.18 55.15,32.48 IC6.47
  Top 0.305: APU.3 APU.4
  Bottom 0.152: v73.32,29.31 79.2,29.31 80.85,27.66 86.33,27.66 v86.62,27.36 | 21.72,5.95 R2.2 31.02,6.33 37.19,12.5 42.93,12.5 49.57,19.13 49.57,21.99 52.05,24.47 53.27,24.47 56.45,27.65 v56.45,27.85
  Bottom 0.305: R2.2 22.33,7.14 APU.4
SCL  (via drill 0.33 pad 0.69)
  Top 0.152: IC12.43 94.92,23.04 95.8,22.16 97.8,22.16 100.2,24.56 v100.2,24.76 | 20.04,51.79 72.57,51.79 v73.76,50.6 | 20.04,51.79 19.85,51.99 14.66,51.99 IC3.6 | R9.2 20.04,51.79
  Bottom 0.152: v73.76,50.6 75.59,48.77 90.15,48.77 100.29,38.63 100.29,24.85 v100.2,24.76
SDA  (via drill 0.33 pad 0.69)
  Top 0.152: IC12.44 95.42,25 98.99,25 v99.25,25.25 | IC3.5 16.35,50.23 22.17,50.23 R8.1 23.1,51.01 23.16,51.07 72.31,51.07 v74.01,49.36
  Bottom 0.152: v74.01,49.36 74.08,49.36 74.98,48.46 90.01,48.46 99.93,38.54 99.93,25.93 v99.25,25.25
SELECT  (via drill 0.33 pad 0.69)
  Top 0.152: IC12.82 95.42,40.99 95.37,40.99 89.36,47.01 88.23,47.01 87.4,47.84 73.81,47.84 61.95,35.98 v61.95,27.18 | SELECT.3 SELECT.4
  Bottom 0.152: v61.95,27.18 58.13,23.35 56.48,23.35 55.14,22.01 55.14,19.61 55.82,18.92 58.95,18.92 68.75,9.12 72.62,9.12 73.79,9.12 74.37,8.53 74.37,7.94 R7.2 76.4,5.72 SELECT.4
SO
  Top 0.152: IC10.15 32.74,28.12 35.49,28.12 36.39,27.22 38.21,27.22 40.85,29.86 40.85,37.28 44.19,40.62 44.75,40.62 53.29,32.08 53.29,30.08 IC6.44
UP  (via drill 0.33 pad 0.69)
  Top 0.152: IC12.85 93.92,40.75 88.58,46.09 87.5,46.09 86.71,46.89 74.24,46.89 64.41,37.05 v64.41,28.85 | UP.3 UP.4
  Bottom 0.152: v64.41,28.85 63.67,28.11 58.88,28.11 57.2,26.44 57.01,26.44 52.6,22.02 52.6,13.39 55.07,10.92 UP.4 | R12.2 48.56,9.18 UP.3
VCC  (via drill 0.33, 0.33 pad 0.69)
  Top 0.305: 92.28,45.39 92.91,46.02 95.71,46.02 96.45,45.29 | v92.17,45 92.17,45.29 92.28,45.39 | 92.28,45.39 89.75,47.91 89.75,48.53 R26.2 88.9,50.29 R27.2 | C26.1 81.74,34.69 82.3,34.69 83.37,33.62 83.37,33.52 IC12.10 88.46,33.52 91.72,30.25 | IC12.80 96.42,41.07 96.45,41.1 C27.1 96.45,45.29 | IC12.100 86.42,38.96 86.14,38.96 85.72,39.38 v85.72,39.62 | IC12.31 88.92,25.07 87.99,26 v87.69,26 | ICSP.2 99.06,20.66 99.17,20.66 100.28,19.55 100.28,18.39 F1.1 103.28,17.12 C31.1 105.51,17.43 105.51,18.41 105.61,18.52 v106.45,18.52 | ICSP.2 99.06,22.82 99.28,22.82 102.11,25.65 102.11,30.22 | ICSP.2 97.98,21.74 96.15,19.91 95.48,19.91 | 26.39,38.41 26.31,38.33 26.17,38.33 25.12,37.28 25.12,36.05 | C29.1 109.31,49.14 109.42,49.26 109.42,53.34 109.12,53.65 103.63,53.65 103.33,53.34 103.33,52.73 | 26.39,38.41 26.45,38.47 29.94,41.97 | IC10.7 26.39,38.41 | 103.33,52.73 103.46,52.73 IC15.19 | 103.33,52.73 103.02,52.73 102.81,52.52 IC15.20 102.81,48.97 v99.56,45.72 | v99.56,45.72 99.56,46.14 99.36,46.33 97.5,46.33 96.45,45.29 | IC15.4 v99.56,45.72 | v45.75,26.94 46.12,26.57 IC6.33 46.12,24.38 46.11,24.37 C17.1 46.97,23.47 47.78,22.66 51.05,22.66 JP1.13 51.05,19 65.06,19 67.46,21.4 71.83,21.4 TM1.A | v31.5,29.18 31.47,29.2 31.47,34.59 | IC10.4 30.2,34.59 31.47,34.59 | v73.9,44.98 74.16,44.98 74.21,45.03 IC5.50 | C24.1 11.67,53.19 11.67,52.51 12.12,52.06 IC3.8 12.12,49.25 12.36,49.01 R9.1 R8.2 24.18,49.01 29.94,43.25 | C51.+ 29.94,41.97 | 29.94,43.25 30.86,44.17 32.36,44.17 33.83,42.7 C16.1 33.83,40.99 33.27,40.99 31.47,39.19 IC10.3 31.47,34.59 | 29.94,43.25 29.94,41.97 | C22.2 25.12,36.05
  Top 0.305: 25.12,36.05 IC10.8 | IC6.73 45.32,49.74 v45.05,50 | IC5.57 67.71,47.52 68.06,47.17 v68.06,47.09 | 95.48,15.8 IC4.1 95.52,14.94 v96.32,14.94 | C1.1 95.24,20.15 95.48,19.91 | IC4.3 93.58,15.8 95.48,15.8 | 95.48,19.91 95.48,15.8 | 91.72,30.25 93.06,31.59 98.63,31.59 99.21,31.02 IC12.61 101.48,31.02 101.48,30.85 102.11,30.22 | 91.72,30.25 v91.72,29.91 | C28.1 102.11,30.22
  Bottom 0.305: ICSP.2 97.98,21.74 97.9,21.82 IC11.32 | v106.45,18.52 107.29,19.36 107.29,35.66 99.56,43.39 v99.56,45.72 | v45.75,26.94 44.84,27.85 44.84,28.02 | 89.05,43.69 89.05,42.95 v85.72,39.62 | 89.05,43.69 89.05,44.25 88.32,44.98 v73.9,44.98 72.66,46.22 70.91,46.22 70.47,45.77 70.47,45.21 C7.2 69.19,45.21 | 44.84,28.02 33.52,28.02 33.22,28.32 C15.1 32.22,29.18 v31.5,29.18 | IC7.8 29.03,41.13 29.79,41.88 C51.+ | IC8.28 44.84,28.63 44.84,28.02 | IC9.28 62.28,29.26 63.59,30.57 64.26,30.57 | R2.1 42.16,4.33 42.58,4.75 | 42.58,4.75 R13.1 | v91.72,29.91 91.6,29.91 v87.69,26 | JP1.13 51.05,13 52.26,11.79 R12.1 52.26,8.37 52.12,8.23 52.05,8.15 R11.1 52.05,3.19 51.85,2.99 | v45.05,50 45.59,49.47 45.81,49.47 C19.1 46.66,48.46 47.67,49.48 66.75,49.48 67.2,49.02 67.2,48.46 C18.1 v68.06,47.1 v68.06,47.09 68.06,46.34 69.19,45.21 | 69.19,45.21 66.9,42.93 66.9,42.8 IC1.20 64.26,42.8 64.26,42.37 | 42.58,4.75 46.37,0.96 49.82,0.96 51.85,2.99 | R7.1 62.21,7.85 | 51.85,2.99 53.89,0.95 56.34,0.95 62.21,6.83 62.21,7.85 | 62.21,7.85 R10.1 | 89.05,43.69 C2.2 90.75,43.69 92.07,45 v92.17,45 | TM1.A 71.83,23.64 64.9,30.57 64.26,30.57 | 64.26,30.57 64.26,42.37 | 64.26,42.37 63.68,42.95 63.09,42.95 C23.1 | R3.1 97.89,13.37 v96.32,14.94
VCC3O
  Top 0.305: C30.2 107.27,52.55 106.68,53.03 105.16,53.03 104.76,52.64 IC15.17
XTAL1
  Top 0.152: IC6.45 55.15,30.88 55.15,26.83 54.79,26.47 C21.2 53.86,25.69 53.77,25.6 X2.1
XTAL2
  Top 0.152: IC6.46 55.15,31.68 55.68,31.15 55.68,27.55 56.77,26.47 C20.2 57.7,25.69 57.78,25.6 X2.2
XTAL3
  Top 0.152: R1.1 90.5,18.19 90.84,18.19 90.93,18.28 Y1.3 90.42,21.07 90.42,23.04 IC12.34
XTAL4
  Top 0.152: IC12.33 89.92,25 88.31,26.61 87.44,26.61 86.04,25.21 86.04,22.07 86.33,21.77 86.33,20.56 86.83,20.06 87.44,20.06 Y1.1 87.93,18.28 88.01,18.21 88.5,18.21 R1.2

## Text on the board
tPlace: Hardware SPC Player - Revision 1.02 / Designed by CaitSith2 - Mar 14, 2016 | D7 | D6 | D5 | D4 | D3 | D2 | D1 | D0 | E | R!W | RS | v0 | Vcc | Gnd | L+ | L-
tNames: WHITE | RED | HEADPHONE | LINEOUT
bNames: Micro SD